# EAGLE schematic rPiSchmittv1 (EAGLE 9.1.3)
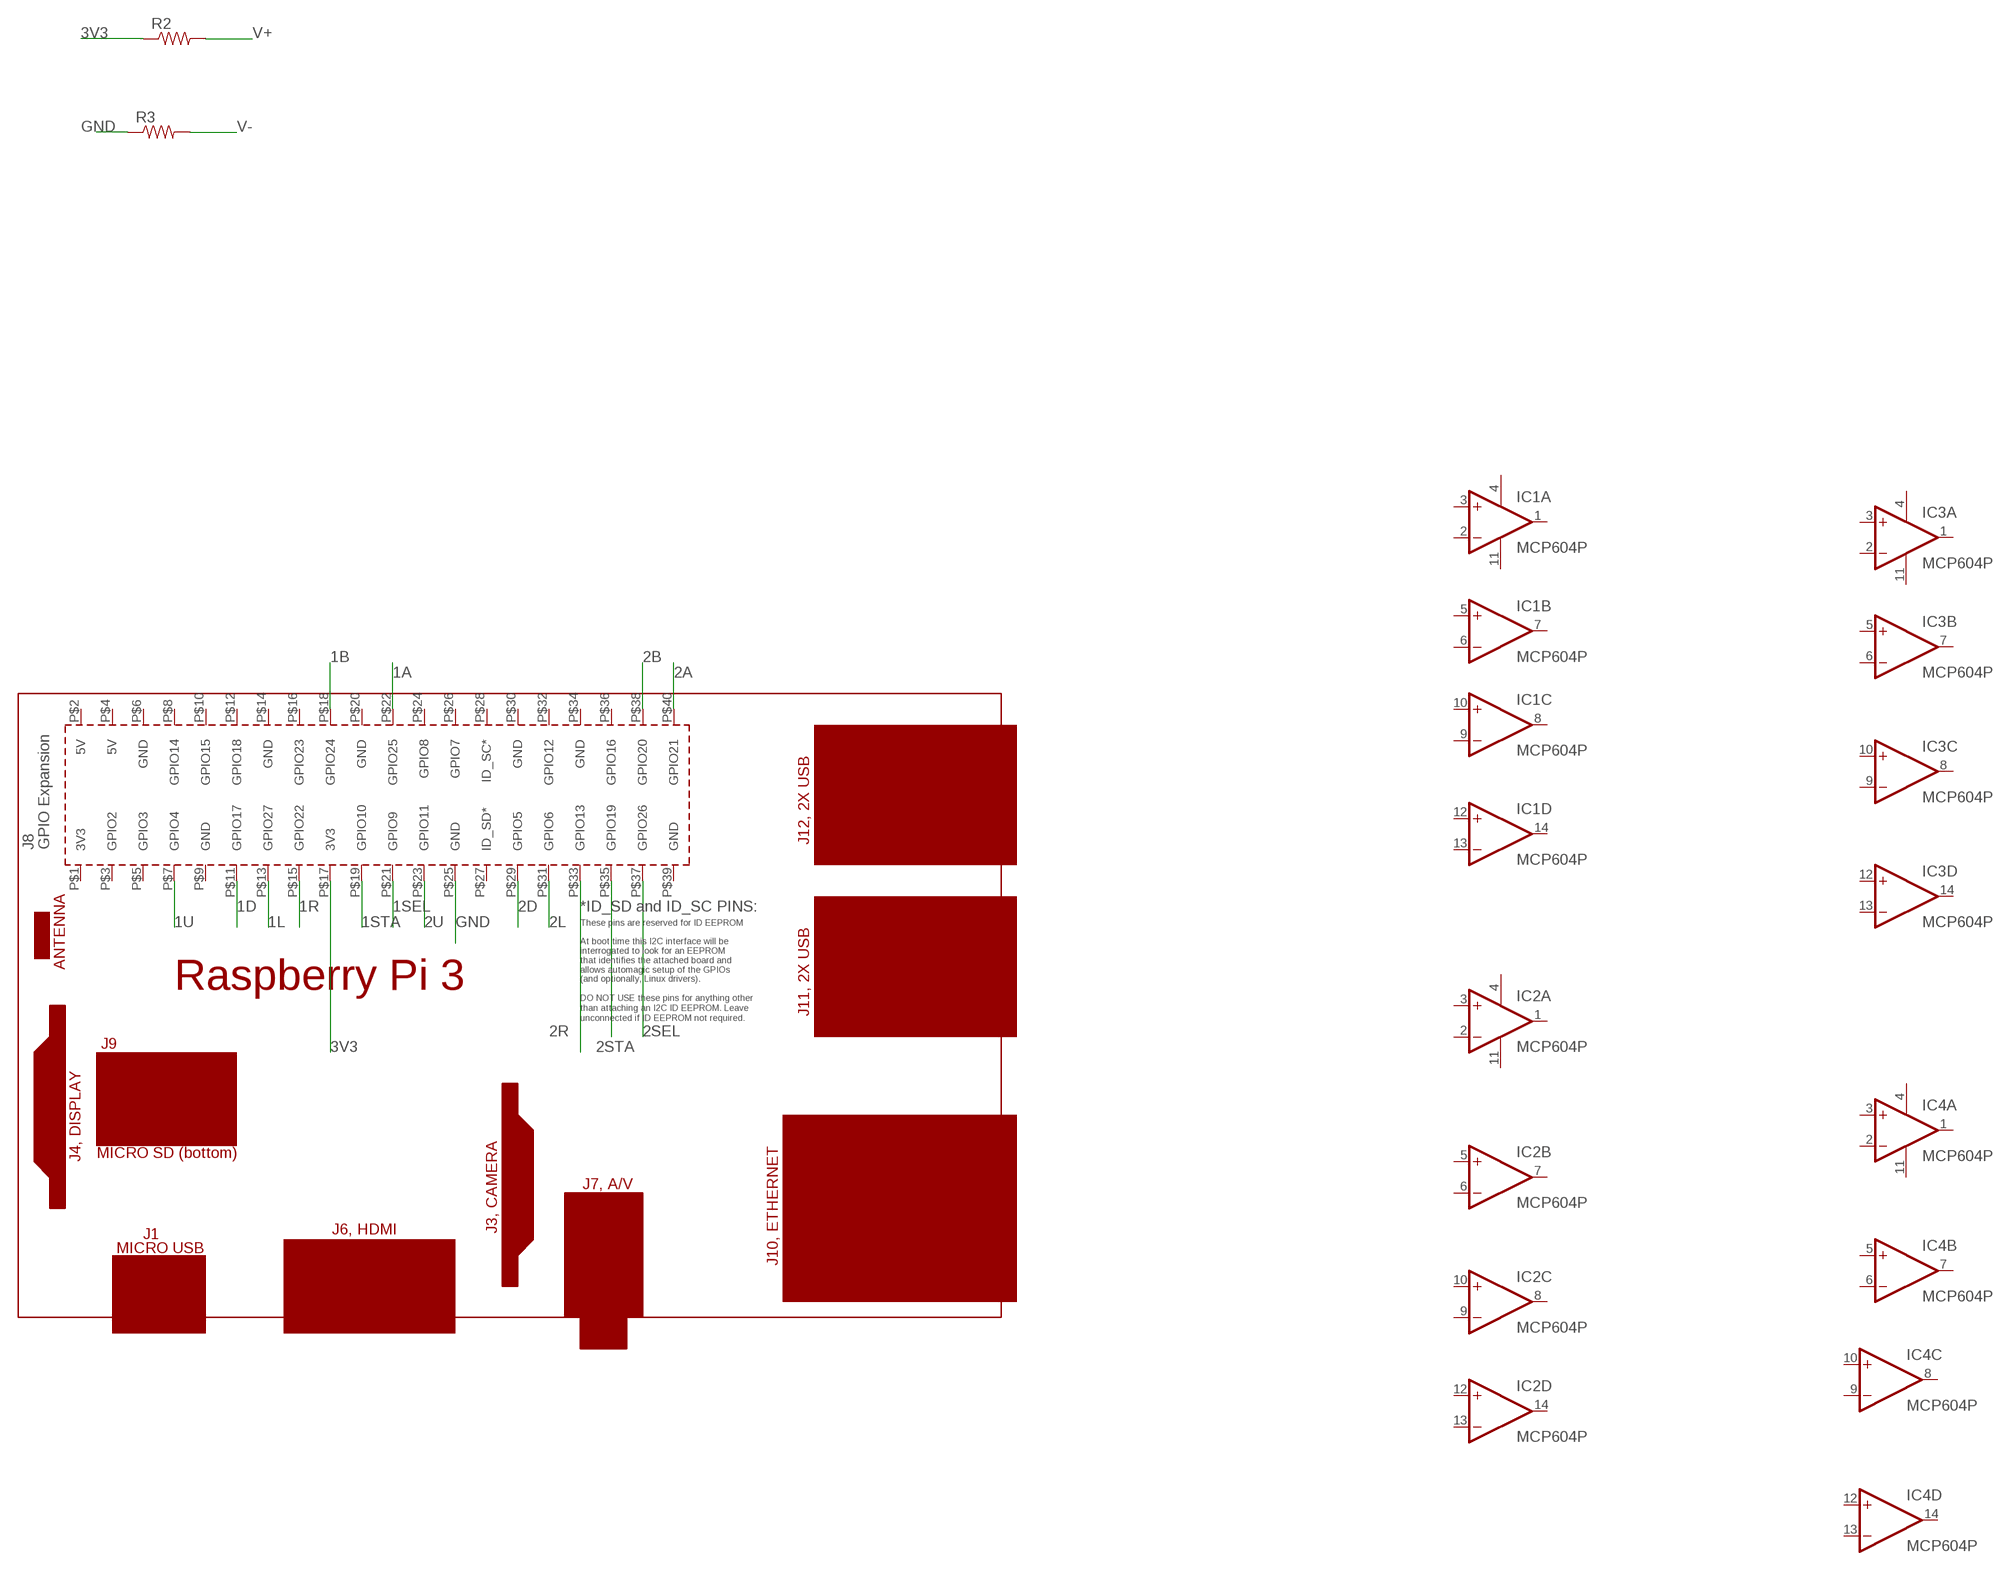
[diagram p0: schematic, sheet 1]

## Parts
IC1  MCP604P  [DIL14]
IC2  MCP604P  [DIL14]
IC3  MCP604P  [DIL14]
IC4  MCP604P  [DIL14]
PCB1  RPI3  [RPI3]
R2  RESISTOR0603-RES  [0603-RES]
R3  RESISTOR0603-RES  [0603-RES]

## Nets
1A: PCB1.P$22(GPIO25)
1B: PCB1.P$18(GPIO24)
1D: PCB1.P$11(GPIO17)
1L: PCB1.P$13(GPIO27)
1R: PCB1.P$15(GPIO22)
1SEL: PCB1.P$21(GPIO9)
1STA: PCB1.P$19(GPIO10)
1U: PCB1.P$7(GPIO4)
2A: PCB1.P$40(GPIO21)
2B: PCB1.P$38(GPIO20)
2D: PCB1.P$29(GPIO5)
2L: PCB1.P$31(GPIO6)
2R: PCB1.P$33(GPIO13)
2SEL: PCB1.P$37(GPIO26)
2STA: PCB1.P$35(GPIO19)
2U: PCB1.P$23(GPIO11)
3V3: PCB1.P$17(3V3) R2.1
GND: PCB1.P$25(GND) R3.1
V+: R2.2
V-: R3.2
Unconnected: IC1.1(A:OUT) IC1.2(A:-IN) IC1.3(A:+IN) IC1.5(B:+IN) IC1.6(B:-IN) IC1.7(B:OUT) IC1.8(C:OUT) IC1.9(C:-IN) IC1.10(C:+IN) IC1.12(D:+IN) IC1.13(D:-IN) IC1.14(D:OUT) IC2.1(A:OUT) IC2.2(A:-IN) IC2.3(A:+IN) IC2.5(B:+IN) IC2.6(B:-IN) IC2.7(B:OUT) IC2.8(C:OUT) IC2.9(C:-IN) IC2.10(C:+IN) IC2.12(D:+IN) IC2.13(D:-IN) IC2.14(D:OUT) IC3.1(A:OUT) IC3.2(A:-IN) IC3.3(A:+IN) IC3.5(B:+IN) IC3.6(B:-IN) IC3.7(B:OUT) IC3.8(C:OUT) IC3.9(C:-IN) IC3.10(C:+IN) IC3.12(D:+IN) IC3.13(D:-IN) IC3.14(D:OUT) IC4.1(A:OUT) IC4.2(A:-IN) IC4.3(A:+IN) IC4.5(B:+IN) IC4.6(B:-IN) IC4.7(B:OUT) IC4.8(C:OUT) IC4.9(C:-IN) IC4.10(C:+IN) IC4.12(D:+IN) IC4.13(D:-IN) IC4.14(D:OUT) PCB1.P$1(3V3) PCB1.P$2(5V) PCB1.P$3(GPIO2) PCB1.P$4(5V) PCB1.P$5(GPIO3) PCB1.P$6(GND) PCB1.P$8(GPIO14) PCB1.P$9(GND) PCB1.P$10(GPIO15) PCB1.P$12(GPIO18) PCB1.P$14(GND) PCB1.P$16(GPIO23) PCB1.P$20(GND) PCB1.P$24(GPIO8) PCB1.P$26(GPIO7) PCB1.P$27(ID_SD*) PCB1.P$28(ID_SC*) PCB1.P$30(GND) PCB1.P$32(GPIO12) PCB1.P$34(GND) PCB1.P$36(GPIO16) PCB1.P$39(GND)

## Power pins joined to a net without a drawn wire
V+: IC1.4(P:V+) IC2.4(P:V+) IC3.4(P:V+) IC4.4(P:V+)
V-: IC1.11(P:V-) IC2.11(P:V-) IC3.11(P:V-) IC4.11(P:V-)

## Library data of the parts
IC1-IC4 = linear:MCP604: Quad Op Amp 2.7V to 6.0V Single Supply CMOS Source: http://ww1.microchip.com/downloads/en/DeviceDoc/21314g.pdf
PCB1 = e14_Rpi3_RevA:RPI3: Device for Raspberry Pi 3 board created by Dave Young for www.element14.com More information and support community is available at https://www.element14.com/community/community/raspberry-pi
R2 R3 = SparkFun-Passives:RESISTOR: Resistor Basic schematic elements and footprints for 0603, 1206, and PTH resistors.